# EasyEDA Pro project 主动响应重力卸载系统电控原理图（单车_无步进电机）.eprj

# Schematic 主动响应重力卸载系统

## Sheets
1 综控柜回路: Create Date: 2024-10-10; Page Name: 综控柜回路; Project Name: 507升级改造; Schematic Name: 主动响应重力卸载系统; Update Date: 2024-10-11; Company: 哈尔滨工业大学; Drawed: 徐化睿; Page Size: A4; Reviewed: 王旭、陈海鹏; Version: V1.0
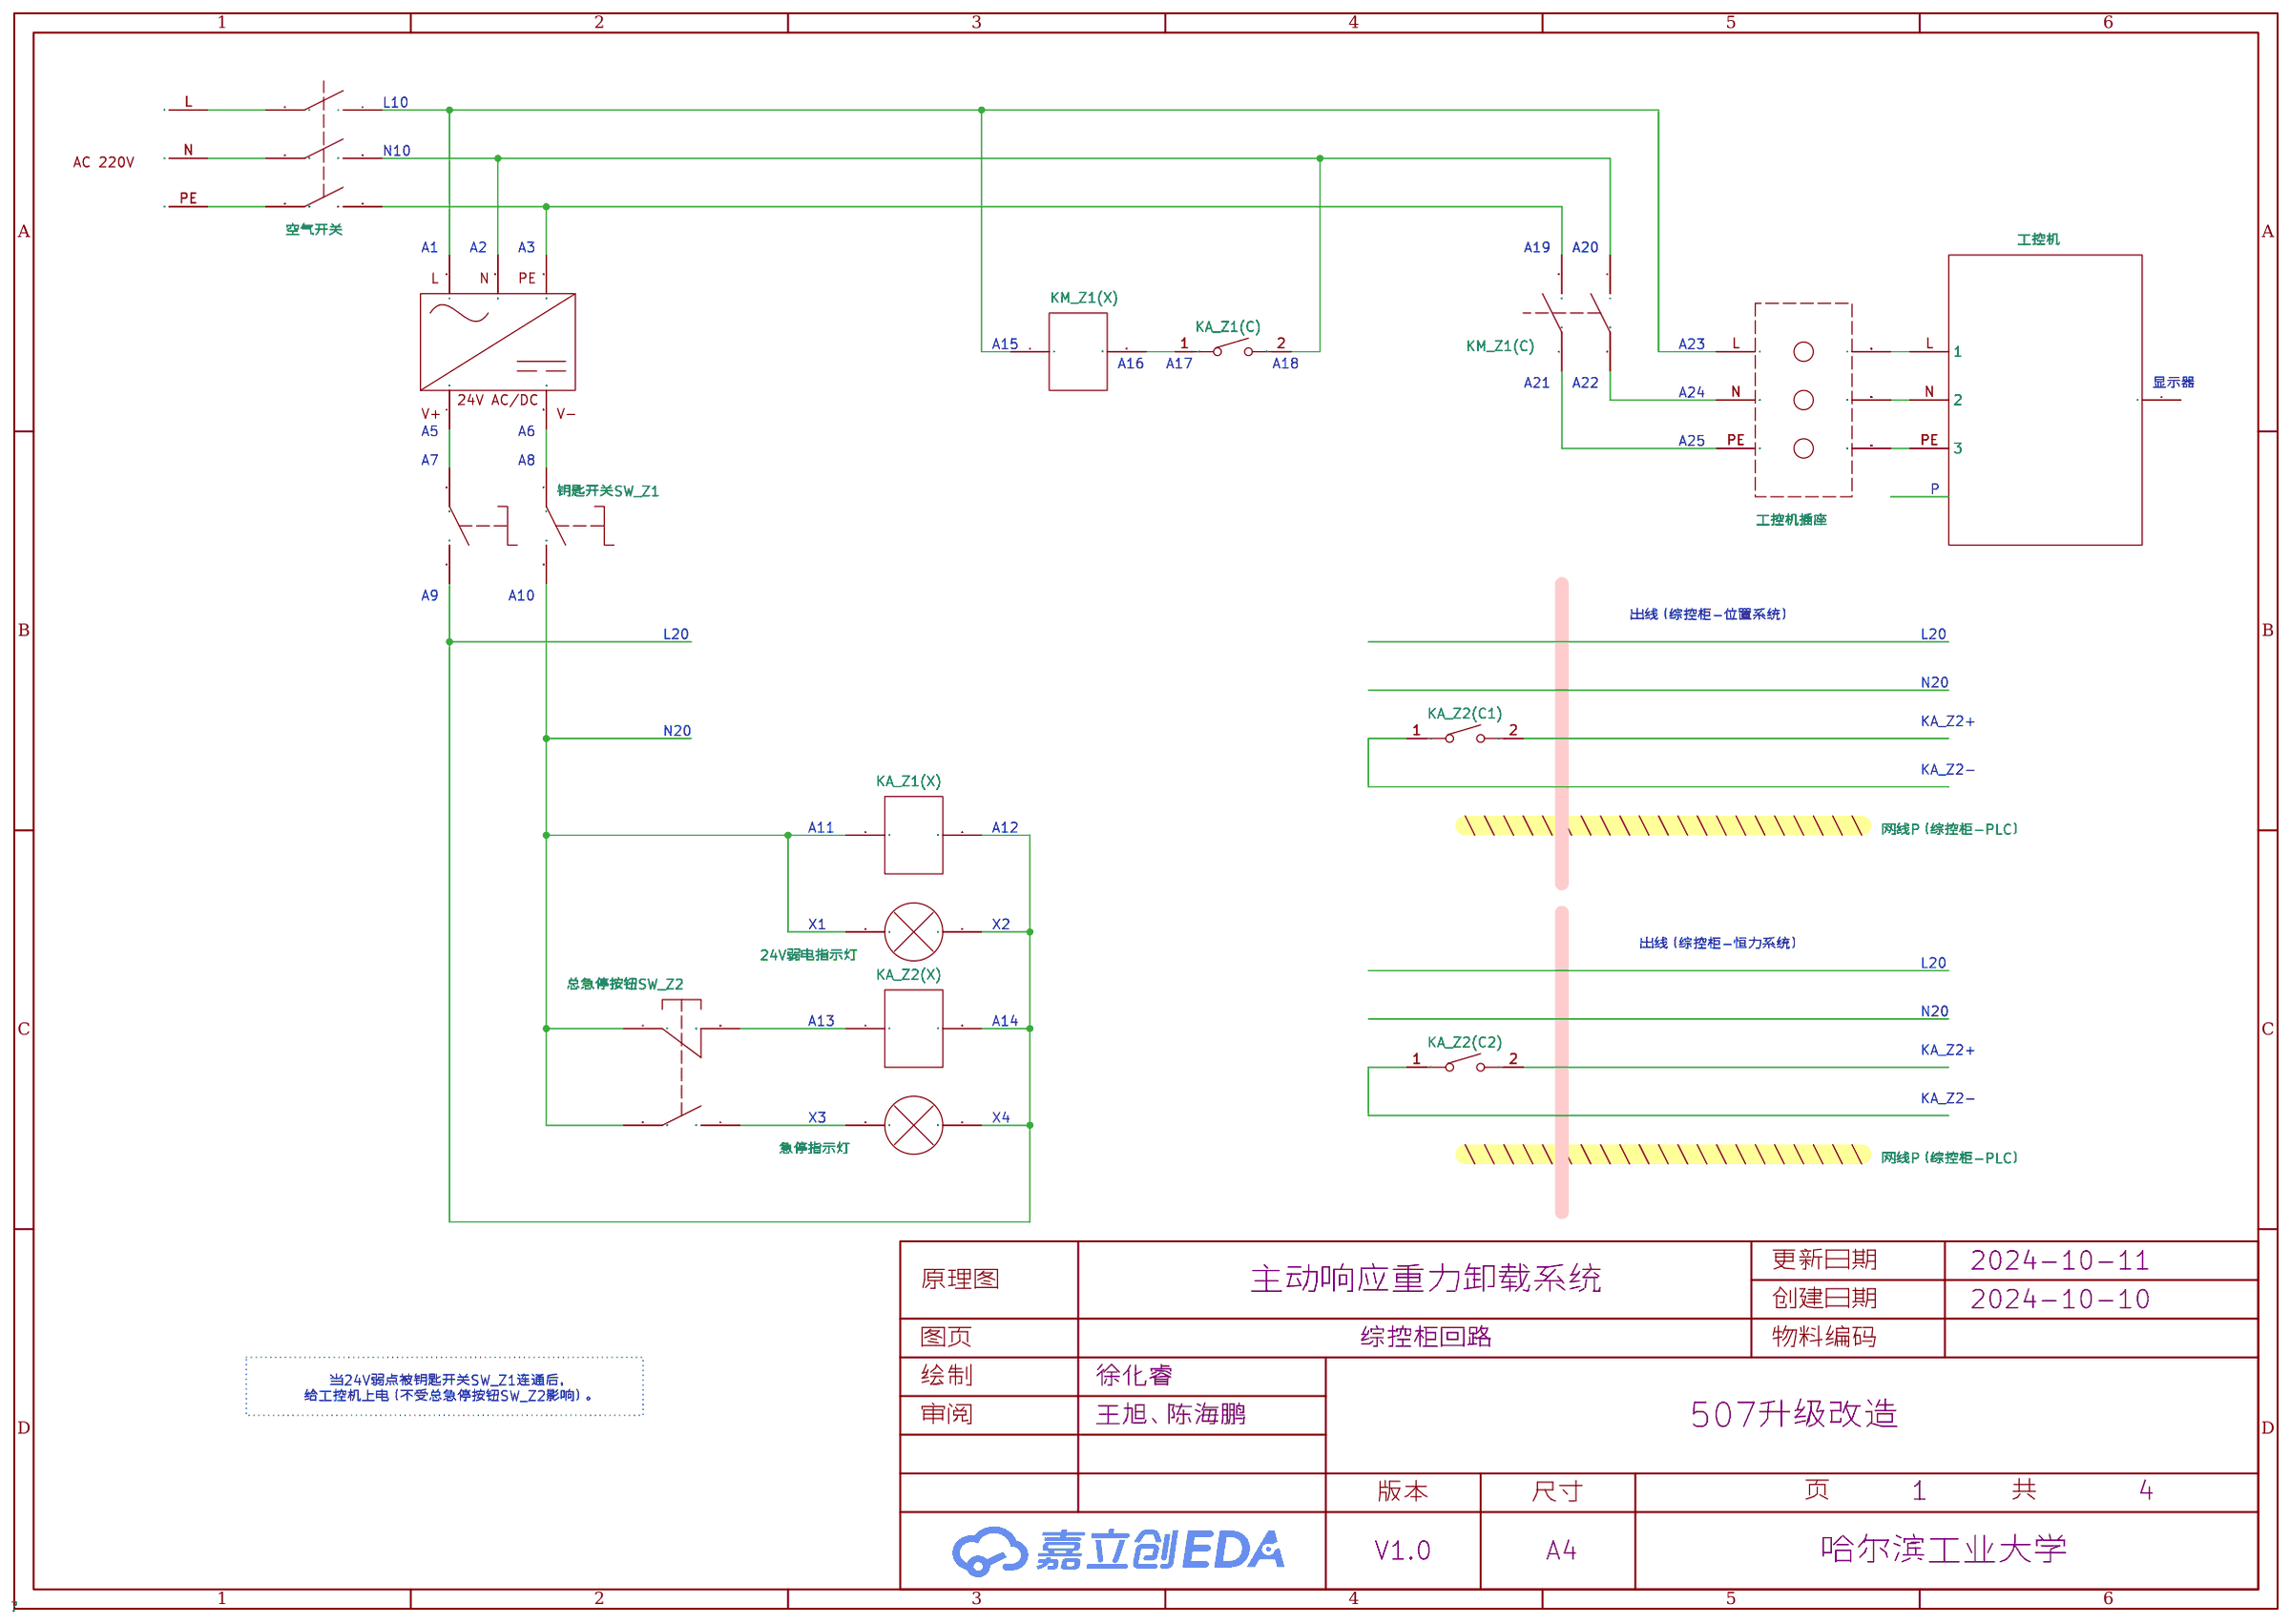
[diagram p0: 综控柜回路]
2 位置系统主回路: Page Name: 位置系统主回路
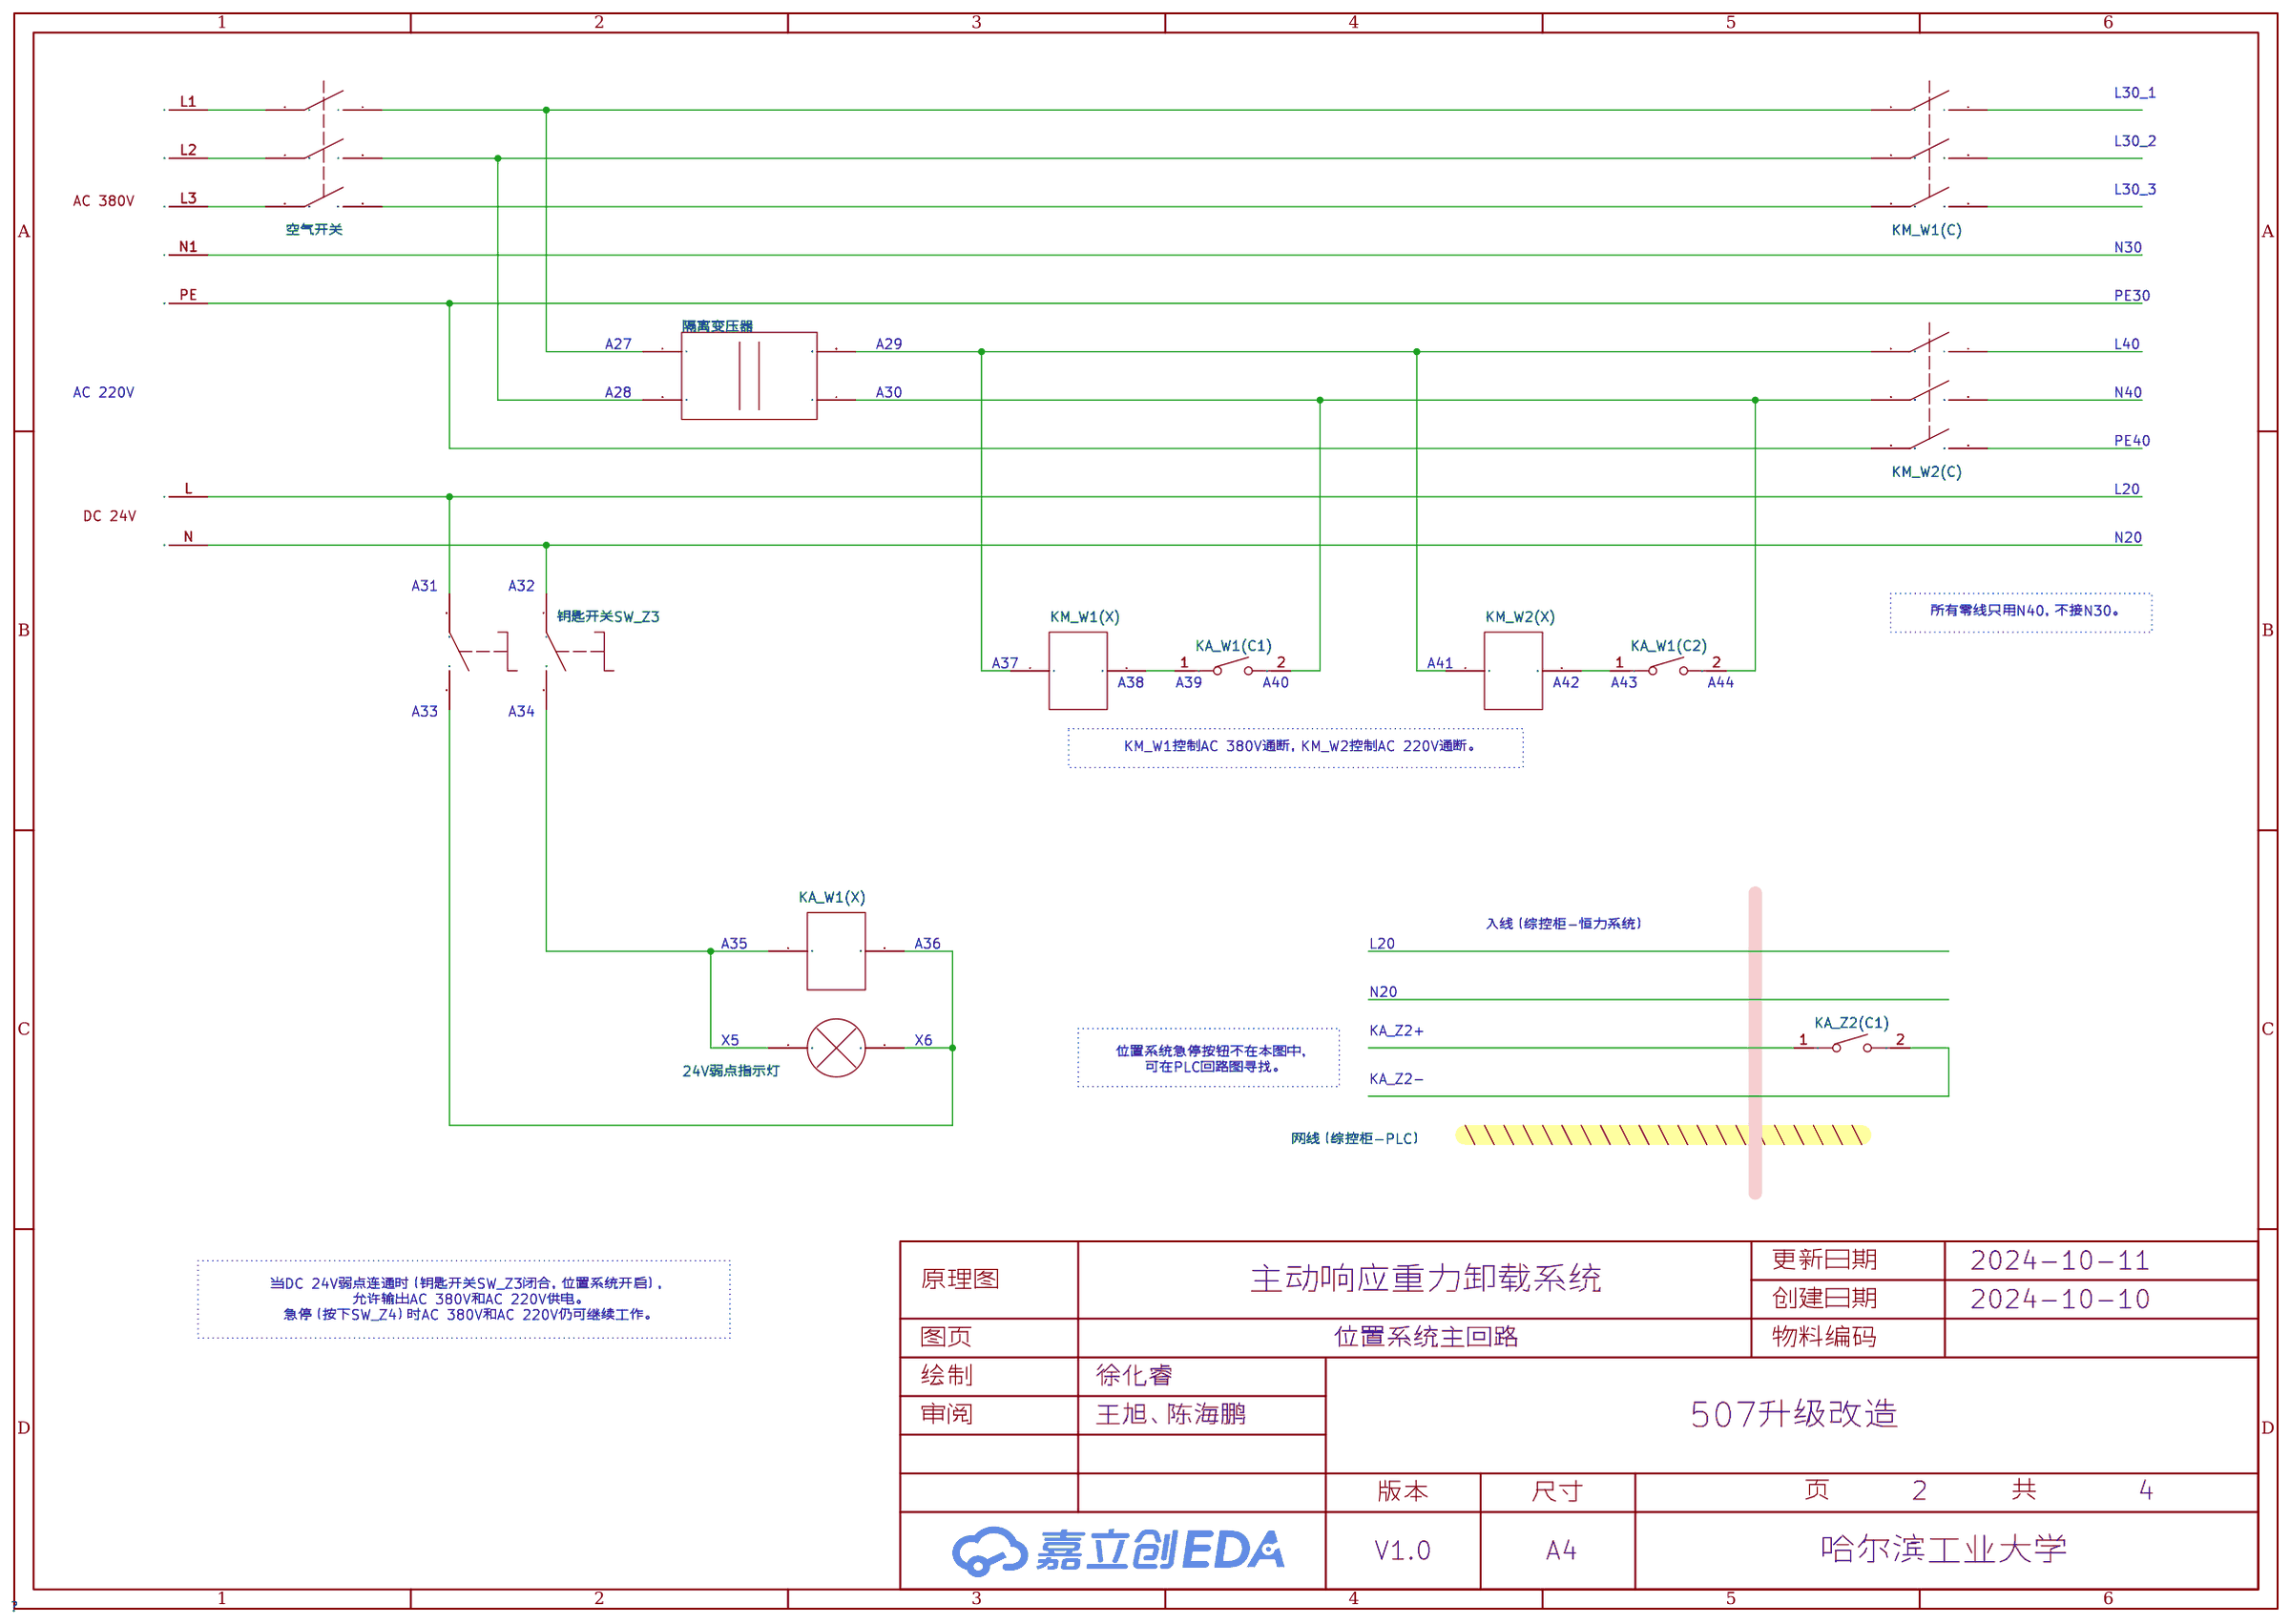
[diagram p1: 位置系统主回路]
3 PLC回路: Create Date: 2024-10-12; Page Name: PLC回路; Project Name: 主动响应重力卸载系统电控原理图（单车_无步进电机）; Update Date: 2024-10-12; Page Size: A3
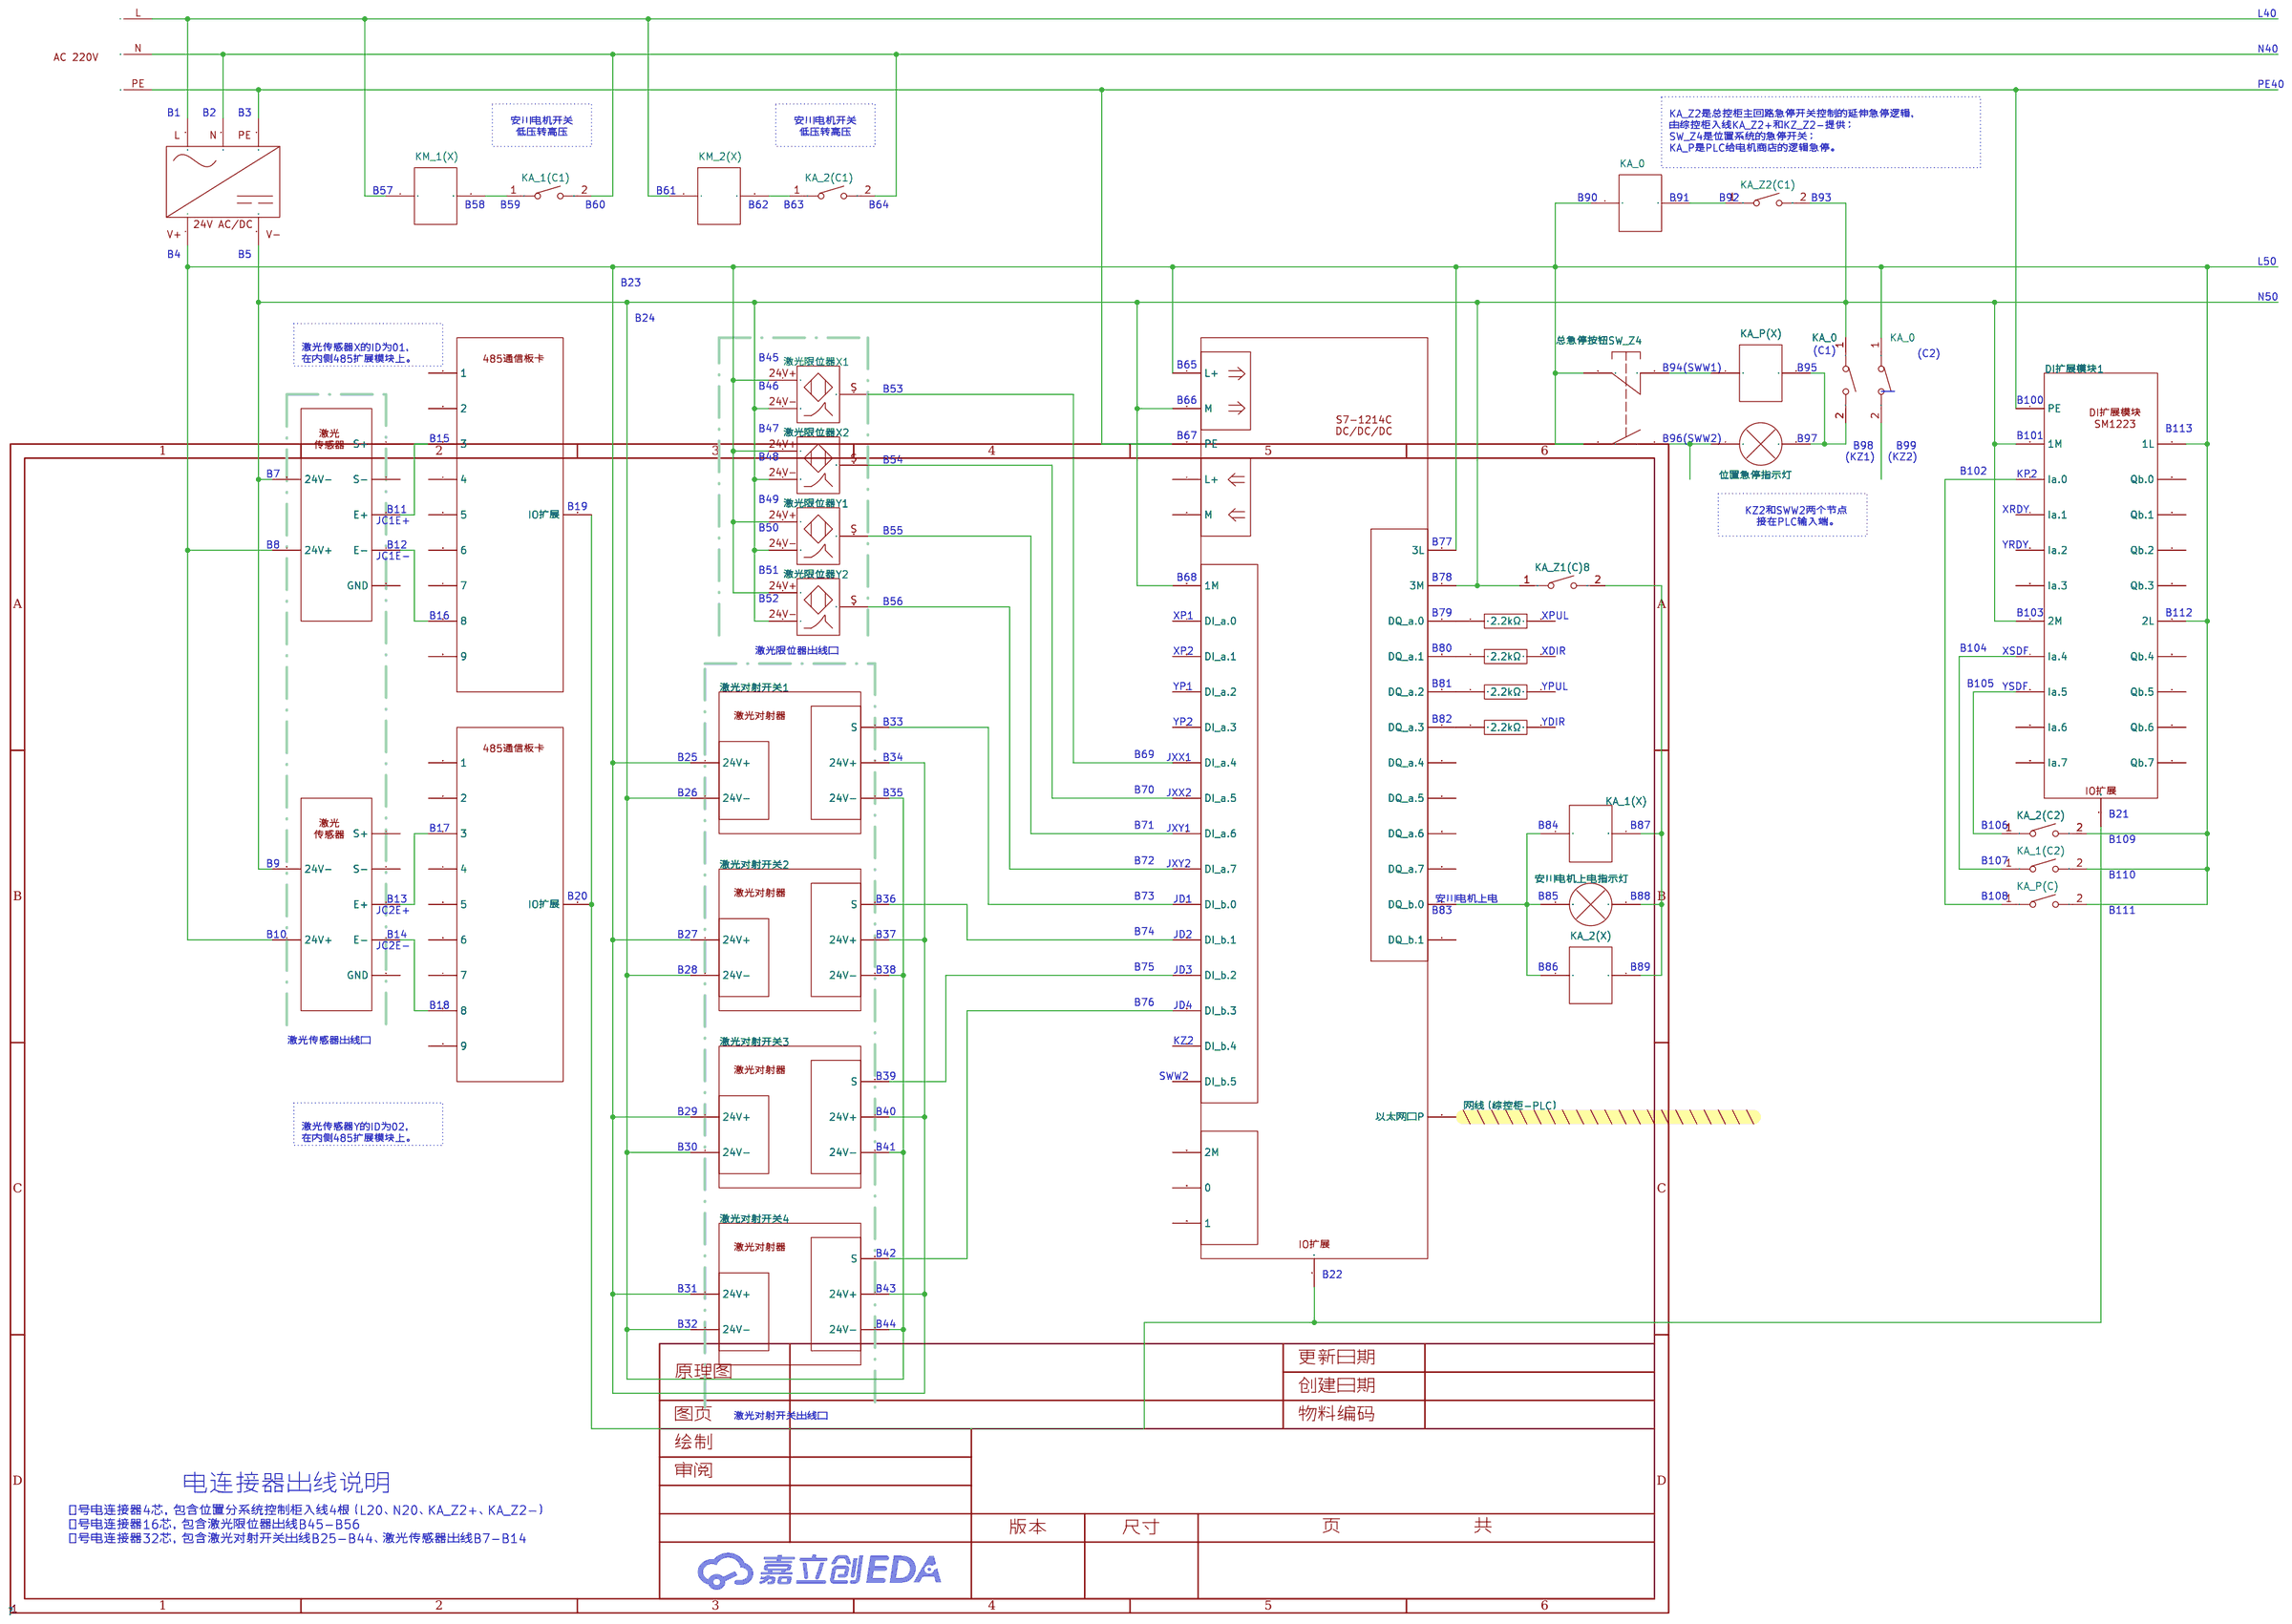
[diagram p2: PLC回路]
4 安川电机驱动器回路: Create Date: 2024-10-11; Page Name: 安川电机驱动器回路
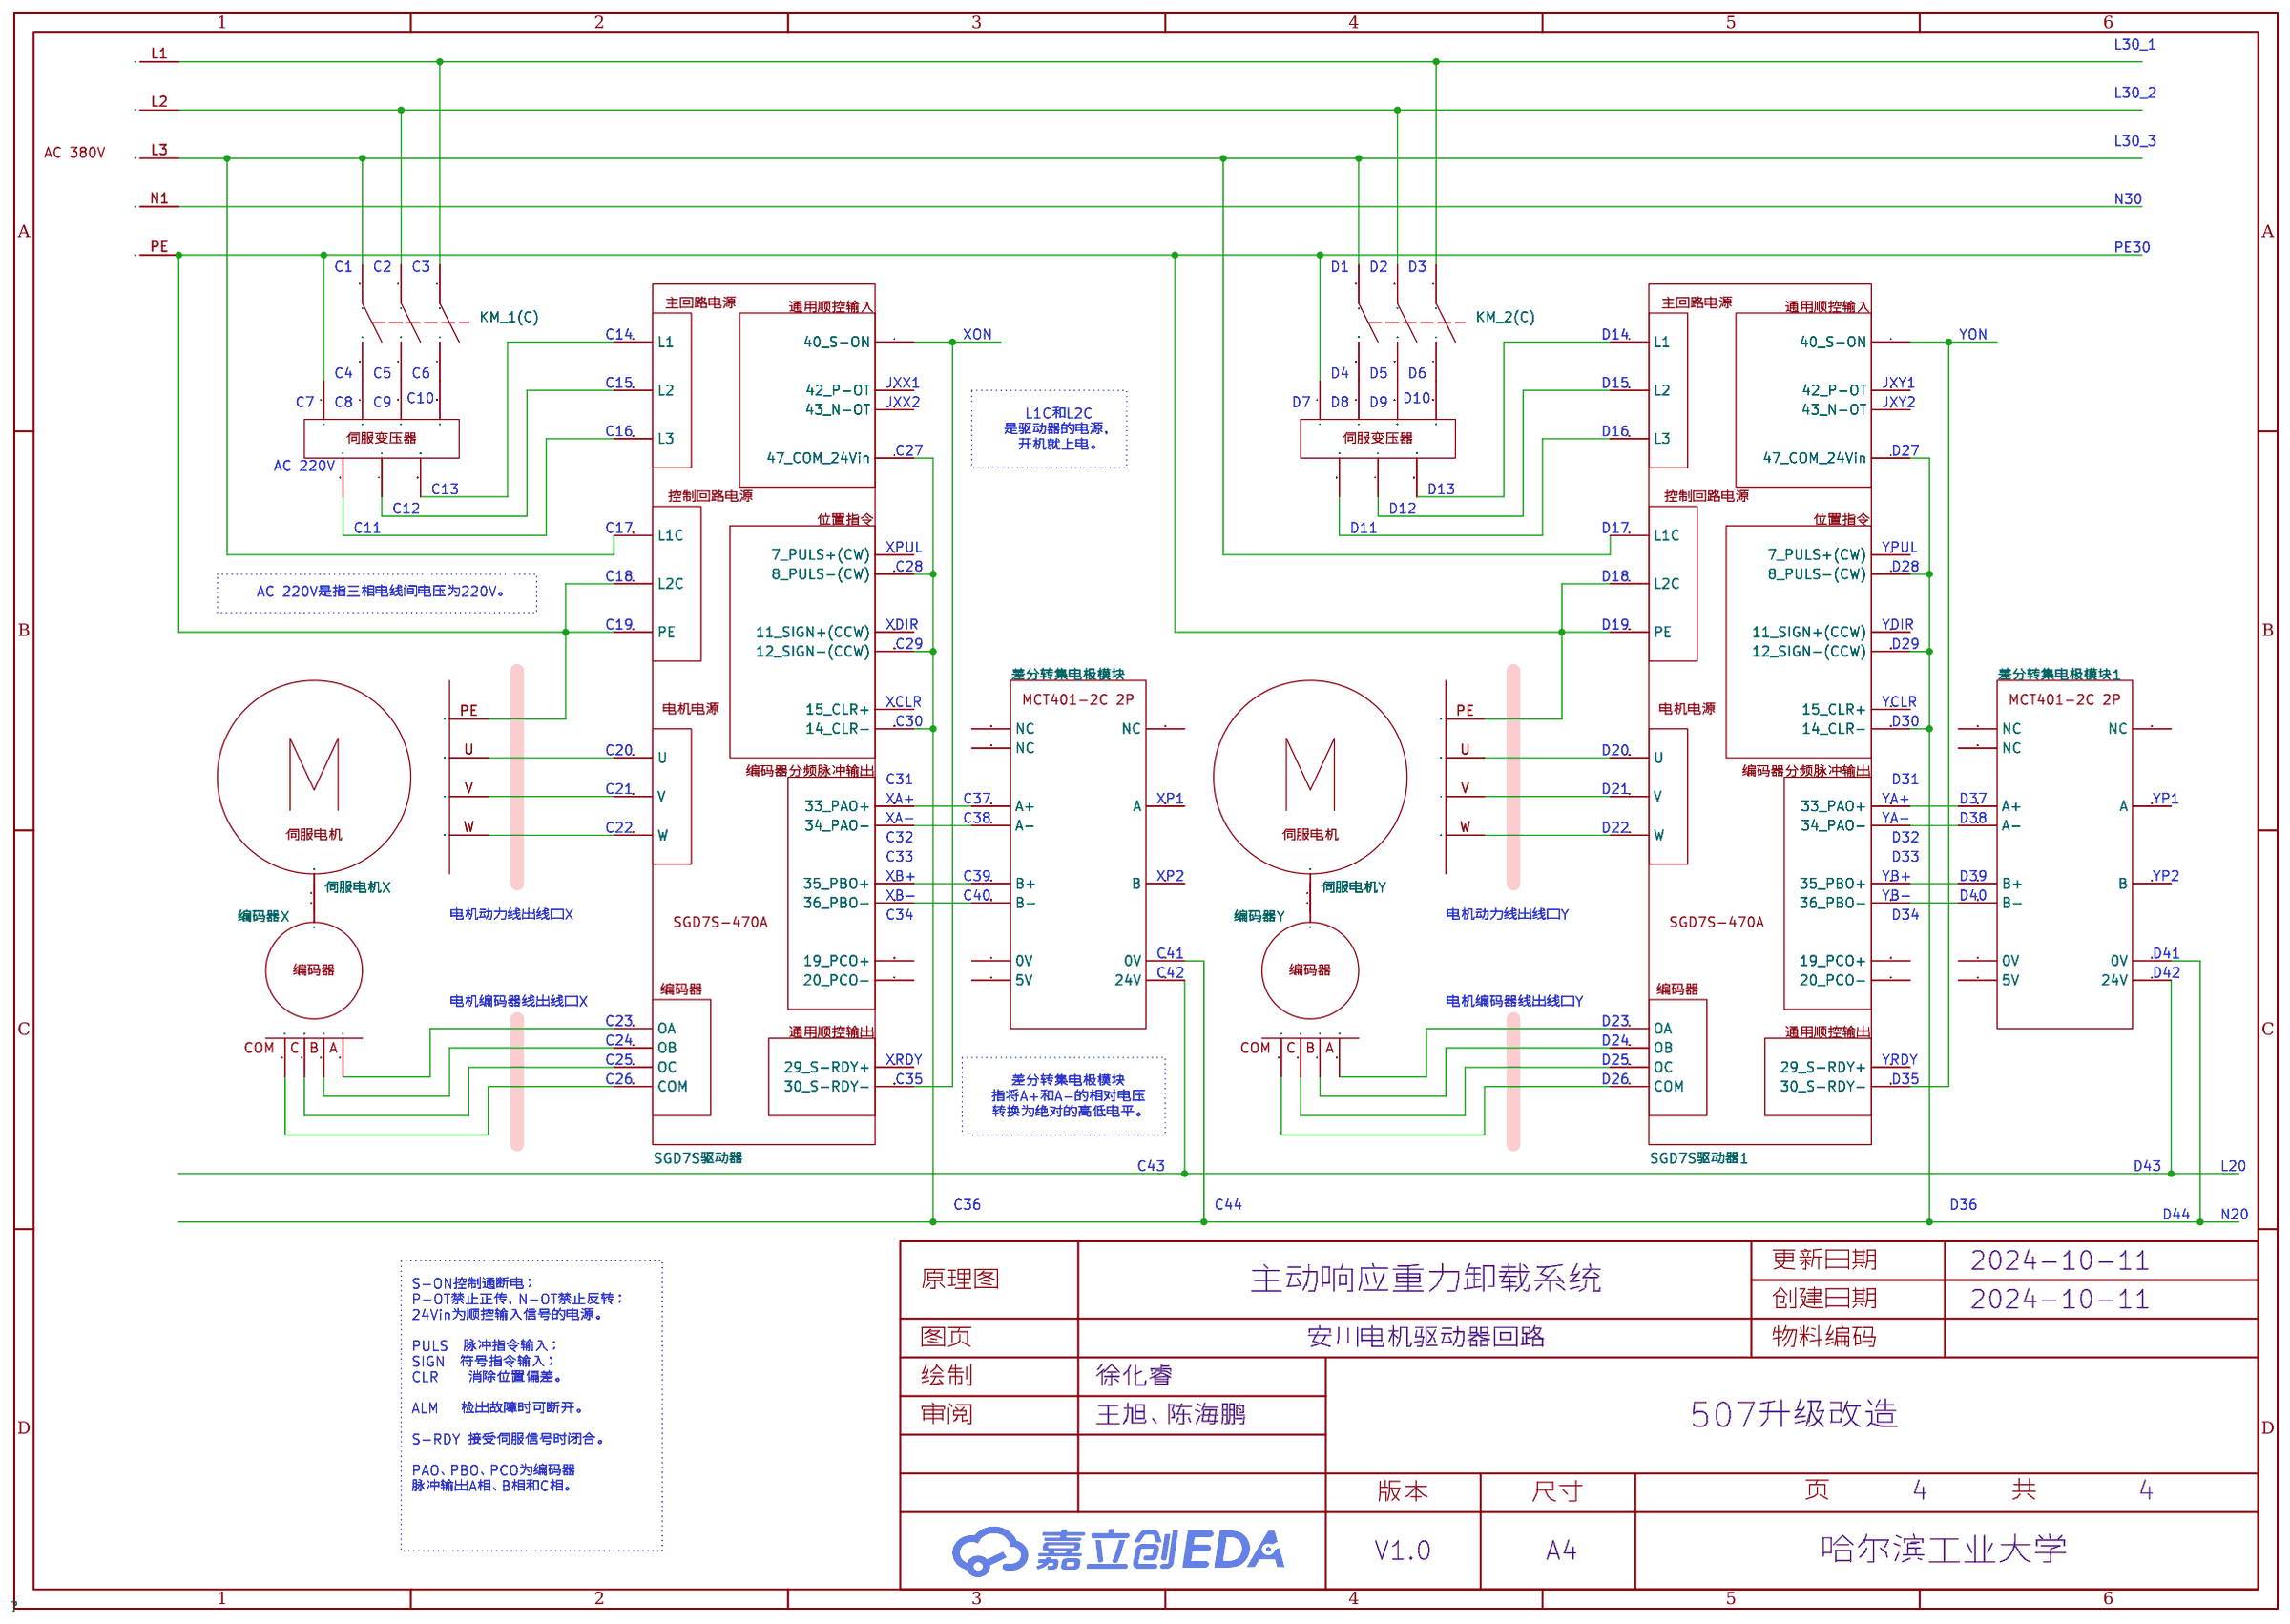
[diagram p3: 安川电机驱动器回路]

## Parts
sheet PLC回路
2.2kΩ  -
2.2kΩ#2  -
2.2kΩ#3  -
2.2kΩ#4  -
DI扩展模块1  -
KA_0  -
KA_0#2  TS-1088-AR02016  [SW-SMD_L3.9-W3.0-P4.45]
KA_0#3  TS-1088-AR02016  [SW-SMD_L3.9-W3.0-P4.45]
KA_1(C1)  TS-1088-AR02016  [SW-SMD_L3.9-W3.0-P4.45]
KA_1(C2)  TS-1088-AR02016  [SW-SMD_L3.9-W3.0-P4.45]
KA_1(X)  -
KA_2(C1)  TS-1088-AR02016  [SW-SMD_L3.9-W3.0-P4.45]
KA_2(C2)  TS-1088-AR02016  [SW-SMD_L3.9-W3.0-P4.45]
KA_2(X)  -
KA_P(C)  TS-1088-AR02016  [SW-SMD_L3.9-W3.0-P4.45]
KA_P(X)  -
KA_Z1(C)8  TS-1088-AR02016  [SW-SMD_L3.9-W3.0-P4.45]
KA_Z2(C1)#3  TS-1088-AR02016  [SW-SMD_L3.9-W3.0-P4.45]
KM_1(X)  -
KM_2(X)  -
U8  -
U9  -
U10  -
U11  -
U12  -
U13  -
U14  -
位置急停指示灯  -
安川电机上电指示灯  -
总急停按钮SW_Z4  -
激光对射开关1  -
激光对射开关2  -
激光对射开关3  -
激光对射开关4  -
激光限位器X1  -
激光限位器X2  -
激光限位器Y1  -
激光限位器Y2  -
sheet 位置系统主回路
24V弱点指示灯  -
KA_W1(C1)  TS-1088-AR02016  [SW-SMD_L3.9-W3.0-P4.45]
KA_W1(C2)  TS-1088-AR02016  [SW-SMD_L3.9-W3.0-P4.45]
KA_W1(X)  -
KA_Z2(C1)#2  TS-1088-AR02016  [SW-SMD_L3.9-W3.0-P4.45]
KM_W1(C)  -
KM_W1(X)  -
KM_W2(C)  -
KM_W2(X)  -
U6  -
U7  -
空气开关#2  -
网线（综控柜-PLC）  -
钥匙开关SW_Z3  -
隔离变压器  -
sheet 安川电机驱动器回路
KM_1(C)  -
KM_2(C)  -
SGD7S驱动器  -
SGD7S驱动器1  -
U17  -
U18  -
U19  -
伺服电机X  -
伺服电机Y  -
差分转集电极模块  -
差分转集电极模块1  -
编码器X  -
编码器Y  -
sheet 综控柜回路
24V弱电指示灯  -
KA_Z1(C)  TS-1088-AR02016  [SW-SMD_L3.9-W3.0-P4.45]
KA_Z1(X)  -
KA_Z2(C1)  TS-1088-AR02016  [SW-SMD_L3.9-W3.0-P4.45]
KA_Z2(C2)  TS-1088-AR02016  [SW-SMD_L3.9-W3.0-P4.45]
KA_Z2(X)  -
KM_Z1(C)  -
KM_Z1(X)  -
U4  -
U5  -
工控机  -
工控机插座  -
急停指示灯  -
总急停按钮SW_Z2  -
空气开关  -
网线P（综控柜-PLC）  -
钥匙开关SW_Z1  -

## Library data of the parts
2.2kΩ 2.2kΩ#2-2.2kΩ#4 = 电阻
DI扩展模块1 = DI扩展模块 SM1223
KA_0 KA_1(X) KA_2(X) KA_P(X) KA_W1(X) KA_Z1(X) KA_Z2(X) KM_1(X) KM_2(X) KM_W1(X) KM_W2(X) KM_Z1(X) = 线圈
KA_0#2 KA_0#3 KA_1(C1) KA_1(C2) KA_2(C1) KA_2(C2) KA_P(C) KA_W1(C1) KA_W1(C2) KA_Z1(C) KA_Z1(C)8 KA_Z2(C1) KA_Z2(C1)#2 KA_Z2(C1)#3 KA_Z2(C2) = TS-1088-AR02016: 电路结构:单刀单掷;按钮形状:圆形按钮;作用力:160gf;安装方式:立贴;开关长度:4mm;开关宽度:3mm;开关高度:2mm;带支架:不带;触点电流:50mA;额定电压(DC):12V;绝缘电阻:100MΩ;机械寿命:10万次;; LCSC Part Name: 4*3*2mm 立贴 轻触开关; Supplier Part: C720477; Manufacturer: XUNPU(讯普); Supplier Footprint: SMD; JLCPCB Part Class: 扩展库; Datasheet: https://atta.szlcsc.com/upload/public/pdf/source/20200810/C720475_60D09DD6C54279ADDB2DC25100F1CC11.pdf; Supplier: LCSC; Circuit: 单刀单掷; Actuator Style: 圆形按钮; Operating Force: 160gf; Mounting Style: 立贴; Switch Length: 4mm; Switch Width: 3mm; Switch Height: 2mm; Strike Gundam: 不带; Contact Current: 50mA; Voltage Rating (DC): 12V; Insulation Resistance: 100MΩ; Actuator/Cap Color: 黑色; Pin Style: SMD接片; Mechanical Life: 10万次; Operating Temperature: -30℃~+80℃
U4 U8 = 220V
U9 = S7-1214C DC/DC/DC
U5 U10 = 24V AC/DC
U11 U12 = 485通信板卡
U13 U14 = 激光传感器
24V弱点指示灯 24V弱电指示灯 位置急停指示灯 安川电机上电指示灯 急停指示灯 = 指示灯
总急停按钮SW_Z2 总急停按钮SW_Z4 = 急停按钮
激光对射开关1-激光对射开关4 = 激光对射开关
激光限位器X1 激光限位器X2 激光限位器Y1 激光限位器Y2 = 激光限位器
KM_W1(C) KM_W2(C) 空气开关 空气开关#2 = 空气开关（三头）
U6 U17 = 380V
U7 = 24V
网线P（综控柜-PLC） 网线（综控柜-PLC） = 网线
钥匙开关SW_Z1 钥匙开关SW_Z3 = 钥匙开关（两头）
隔离变压器 = 隔离变压器
KM_1(C) KM_2(C) = 开关（三头4格）
SGD7S驱动器 SGD7S驱动器1 = SGD7S-470A
U18 U19 = 伺服变压器
伺服电机X 伺服电机Y = 伺服电机
差分转集电极模块 差分转集电极模块1 = MCT401-2C 2P
编码器X 编码器Y = 编码器
KM_Z1(C) = 开关（两头）
工控机 = 工控机
工控机插座 = 工控机插排

## Nets
Net-(2.2kΩ#2-1): 2.2kΩ#2.1 U9.26(DQ a.1)
Net-(2.2kΩ#3-1): 2.2kΩ#3.1 U9.27(DQ a.2)
Net-(2.2kΩ#4-1): 2.2kΩ#4.1 U9.28(DQ a.3)
Net-(2.2kΩ-1): 2.2kΩ.1 U9.25(DQ a.0)
Net-(24V弱点指示灯-1): 24V弱点指示灯.1 KA_W1(X).1 钥匙开关SW_Z3.3
Net-(24V弱点指示灯-2): 24V弱点指示灯.2 KA_W1(X).2 钥匙开关SW_Z3.4
Net-(24V弱电指示灯-1): 24V弱电指示灯.1 KA_Z1(X).1 总急停按钮SW_Z2.1 总急停按钮SW_Z2.2 钥匙开关SW_Z1.3
Net-(24V弱电指示灯-2): 24V弱电指示灯.2 KA_Z1(X).2 KA_Z2(X).2 急停指示灯.2 钥匙开关SW_Z1.4
Net-(DI扩展模块1-1): DI扩展模块1.1(PE) U8.PE(3) U9.3(PE) U10.3
Net-(DI扩展模块1-2): DI扩展模块1.2(1M) DI扩展模块1.21(2M) KA_0#2.1 KA_Z1(C)8.1 KA_Z2(C1)#3.2 U9.2(M) U9.6(1M) U9.24(3M) U10.5 U13.6(24V-) U14.6(24V-) 激光对射开关1.2(24V-) 激光对射开关1.3(24V-) 激光对射开关2.2(24V-) 激光对射开关2.3(24V-) 激光对射开关3.2(24V-) 激光对射开关3.3(24V-) 激光对射开关4.2(24V-) 激光对射开关4.3(24V-) 激光限位器X1.2 激光限位器X2.2 激光限位器Y1.2 激光限位器Y2.2
Net-(DI扩展模块1-3): DI扩展模块1.3(Ia.0) KA_P(C).1
Net-(DI扩展模块1-7): DI扩展模块1.7(Ia.4) KA_1(C2).1
Net-(DI扩展模块1-8): DI扩展模块1.8(Ia.5) KA_2(C2).1
Net-(DI扩展模块1-11): DI扩展模块1.11(1L) DI扩展模块1.20(2L) KA_0.1 KA_0#3.1 KA_1(C2).2 KA_2(C2).2 KA_P(C).2 U9.1(L+) U9.35(3L) U10.4 U13.7(24V+) U14.7(24V+) 总急停按钮SW_Z4.1 总急停按钮SW_Z4.2 激光对射开关1.1(24V+) 激光对射开关1.4(24V+) 激光对射开关2.1(24V+) 激光对射开关2.4(24V+) 激光对射开关3.1(24V+) 激光对射开关3.4(24V+) 激光对射开关4.1(24V+) 激光对射开关4.4(24V+) 激光限位器X1.1 激光限位器X2.1 激光限位器Y1.1 激光限位器Y2.1
Net-(DI扩展模块1-22): DI扩展模块1.22(2M1) U9.37(M1) U11.10(IO扩展) U12.10(IO扩展)
Net-(KA_0#2-2): KA_0#2.2 KA_P(X).2 位置急停指示灯.2
Net-(KA_0-2): KA_0.2 KA_Z2(C1)#3.1
Net-(KA_1(C1)-1): KA_1(C1).1 KM_1(X).2
Net-(KA_1(C1)-2): KA_1(C1).2 KA_2(C1).2 U8.N(2) U10.2
Net-(KA_1(X)-1): KA_1(X).1 KA_2(X).1 U9.33(DQ b.0) 安川电机上电指示灯.1
Net-(KA_1(X)-2): KA_1(X).2 KA_2(X).2 KA_Z1(C)8.2 安川电机上电指示灯.2
Net-(KA_2(C1)-1): KA_2(C1).1 KM_2(X).2
Net-(KA_P(X)-1): KA_P(X).1 总急停按钮SW_Z4.3
Net-(KA_W1(C1)-1): KA_W1(C1).1 KM_W1(X).2
Net-(KA_W1(C1)-2): KA_W1(C1).2 KA_W1(C2).2 KM_W2(C).2 隔离变压器.4
Net-(KA_W1(C2)-1): KA_W1(C2).1 KM_W2(X).2
Net-(KA_Z1(C)-1): KA_Z1(C).1 KM_Z1(X).2
Net-(KA_Z1(C)-2): KA_Z1(C).2 KM_Z1(C).4 U5.2 空气开关.5
Net-(KA_Z2(X)-1): KA_Z2(X).1 总急停按钮SW_Z2.3
Net-(KM_1(C)-1): KM_1(C).1 KM_2(C).1 U17.L1(1)
Net-(KM_1(C)-2): KM_1(C).2 KM_2(C).2 U17.L2(2)
Net-(KM_1(C)-3): KM_1(C).3 KM_2(C).3 SGD7S驱动器.8(L1C) SGD7S驱动器1.8(L1C) U17.L3(3)
Net-(KM_1(C)-4): KM_1(C).4 U18.3
Net-(KM_1(C)-5): KM_1(C).5 U18.2
Net-(KM_1(C)-6): KM_1(C).6 U18.1
Net-(KM_1(X)-1): KM_1(X).1 KM_2(X).1 U8.L(1) U10.1
Net-(KM_2(C)-4): KM_2(C).4 U19.3
Net-(KM_2(C)-5): KM_2(C).5 U19.2
Net-(KM_2(C)-6): KM_2(C).6 U19.1
Net-(KM_W1(C)-1): KM_W1(C).1 空气开关#2.4 隔离变压器.1
Net-(KM_W1(C)-2): KM_W1(C).2 空气开关#2.5 隔离变压器.2
Net-(KM_W1(C)-3): KM_W1(C).3 空气开关#2.6
Net-(KM_W1(X)-1): KM_W1(X).1 KM_W2(C).1 KM_W2(X).1 隔离变压器.3
Net-(KM_W2(C)-3): KM_W2(C).3 U6.PE(5)
Net-(KM_Z1(C)-1): KM_Z1(C).1 工控机插座.PE(3)
Net-(KM_Z1(C)-2): KM_Z1(C).2 工控机插座.N(2)
Net-(KM_Z1(C)-3): KM_Z1(C).3 U5.3 空气开关.6
Net-(KM_Z1(X)-1): KM_Z1(X).1 U5.1 工控机插座.L(1) 空气开关.4
Net-(SGD7S驱动器1-1): SGD7S驱动器1.1(L1) U19.6
Net-(SGD7S驱动器1-2): SGD7S驱动器1.2(L2) U19.7
Net-(SGD7S驱动器1-3): SGD7S驱动器1.3(L3) U19.5
Net-(SGD7S驱动器1-4): SGD7S驱动器1.4(40 S-ON) SGD7S驱动器1.23(30 S-RDY-)
Net-(SGD7S驱动器1-13): SGD7S驱动器1.13(U) 伺服电机Y.U(3)
Net-(SGD7S驱动器1-14): SGD7S驱动器1.14(V) 伺服电机Y.V(4)
Net-(SGD7S驱动器1-15): SGD7S驱动器1.15(W) 伺服电机Y.W(5)
Net-(SGD7S驱动器1-16): SGD7S驱动器1.16(33 PAO+) 差分转集电极模块1.21(A+)
Net-(SGD7S驱动器1-17): SGD7S驱动器1.17(34 PAO-) 差分转集电极模块1.20(A-)
Net-(SGD7S驱动器1-18): SGD7S驱动器1.18(35 PBO+) 差分转集电极模块1.19(B+)
Net-(SGD7S驱动器1-19): SGD7S驱动器1.19(36 PBO-) 差分转集电极模块1.18(B-)
Net-(SGD7S驱动器1-24): SGD7S驱动器1.24(OA) 编码器Y.5
Net-(SGD7S驱动器1-25): SGD7S驱动器1.25(OB) 编码器Y.4
Net-(SGD7S驱动器1-26): SGD7S驱动器1.26(OC) 编码器Y.3
Net-(SGD7S驱动器1-27): SGD7S驱动器1.27(COM) 编码器Y.2
Net-(SGD7S驱动器-1): SGD7S驱动器.1(L1) U18.6
Net-(SGD7S驱动器-2): SGD7S驱动器.2(L2) U18.7
Net-(SGD7S驱动器-3): SGD7S驱动器.3(L3) U18.5
Net-(SGD7S驱动器-4): SGD7S驱动器.4(40 S-ON) SGD7S驱动器.23(30 S-RDY-)
Net-(SGD7S驱动器-7): SGD7S驱动器.7(47 COM 24Vin) SGD7S驱动器.11(8 PULS-(CW)) SGD7S驱动器.28(12 SIGN-(CCW)) SGD7S驱动器.30(14 CLR-) SGD7S驱动器1.7(47 COM 24Vin) SGD7S驱动器1.11(8 PULS-(CW)) SGD7S驱动器1.28(12 SIGN-(CCW)) SGD7S驱动器1.30(14 CLR-) 差分转集电极模块.27(0V) 差分转集电极模块1.27(0V)
Net-(SGD7S驱动器-9): SGD7S驱动器.9(L2C) SGD7S驱动器.10(PE) SGD7S驱动器1.9(L2C) SGD7S驱动器1.10(PE) U17.PE(5) U18.4 U19.4 伺服电机X.PE(2) 伺服电机Y.PE(2)
Net-(SGD7S驱动器-13): SGD7S驱动器.13(U) 伺服电机X.U(3)
Net-(SGD7S驱动器-14): SGD7S驱动器.14(V) 伺服电机X.V(4)
Net-(SGD7S驱动器-15): SGD7S驱动器.15(W) 伺服电机X.W(5)
Net-(SGD7S驱动器-16): SGD7S驱动器.16(33 PAO+) 差分转集电极模块.21(A+)
Net-(SGD7S驱动器-17): SGD7S驱动器.17(34 PAO-) 差分转集电极模块.20(A-)
Net-(SGD7S驱动器-18): SGD7S驱动器.18(35 PBO+) 差分转集电极模块.19(B+)
Net-(SGD7S驱动器-19): SGD7S驱动器.19(36 PBO-) 差分转集电极模块.18(B-)
Net-(SGD7S驱动器-24): SGD7S驱动器.24(OA) 编码器X.5
Net-(SGD7S驱动器-25): SGD7S驱动器.25(OB) 编码器X.4
Net-(SGD7S驱动器-26): SGD7S驱动器.26(OC) 编码器X.3
Net-(SGD7S驱动器-27): SGD7S驱动器.27(COM) 编码器X.2
Net-(U4-L): U4.L(1) 空气开关.1
Net-(U4-N): U4.N(2) 空气开关.2
Net-(U4-PE): U4.PE(3) 空气开关.3
Net-(U5-4): U5.4 钥匙开关SW_Z1.2
Net-(U5-5): U5.5 钥匙开关SW_Z1.1
Net-(U6-L1): U6.L1(1) 空气开关#2.1
Net-(U6-L2): U6.L2(2) 空气开关#2.2
Net-(U6-L3): U6.L3(3) 空气开关#2.3
Net-(U7-L): U7.L(1) 钥匙开关SW_Z3.2
Net-(U7-N): U7.N(2) 钥匙开关SW_Z3.1
Net-(U9-11): U9.11(DI a.4) 激光限位器X1.3
Net-(U9-12): U9.12(DI a.5) 激光限位器X2.3
Net-(U9-13): U9.13(DI a.6) 激光限位器Y1.3
Net-(U9-14): U9.14(DI a.7) 激光限位器Y2.3
Net-(U9-15): U9.15(DI b.0) 激光对射开关1.5(S)
Net-(U9-16): U9.16(DI b.1) 激光对射开关2.5(S)
Net-(U9-17): U9.17(DI b.2) 激光对射开关3.5(S)
Net-(U9-18): U9.18(DI b.3) 激光对射开关4.5(S)
Net-(U11-3): U11.3 U13.3(E+)
Net-(U11-8): U11.8 U13.4(E-)
Net-(U12-3): U12.3 U14.3(E+)
Net-(U12-8): U12.8 U14.4(E-)
Net-(伺服电机X-1): 伺服电机X.1 编码器X.1
Net-(伺服电机Y-1): 伺服电机Y.1 编码器Y.1
Net-(位置急停指示灯-1): 位置急停指示灯.1 总急停按钮SW_Z4.4
Net-(工控机-L): 工控机.L(1) 工控机插座.PE1(4)
Net-(工控机-N): 工控机.N(2) 工控机插座.PE2(5)
Net-(工控机-PE): 工控机.PE(3) 工控机插座.PE3(6)
Net-(差分转集电极模块-28): 差分转集电极模块.28(24V) 差分转集电极模块1.28(24V)
Net-(急停指示灯-1): 急停指示灯.1 总急停按钮SW_Z2.4

Not connected (* = marked no-connect by the designer): 2.2kΩ 2; 2.2kΩ#2 2; 2.2kΩ#3 2; 2.2kΩ#4 2; DI扩展模块1 4(Ia.1) 5(Ia.2) 6(Ia.3) 9(Ia.6) 10(Ia.7) 12(Qb.0) 13(Qb.1) 14(Qb.2) 15(Qb.3) 16(Qb.4) 17(Qb.5) 18(Qb.6) 19(Qb.7); KA_0#3 2; KA_Z2(C1) 1 2; KA_Z2(C1)#2 1 2; KA_Z2(C2) 1 2; KM_W1(C) 4 5 6; KM_W2(C) 4 5 6; SGD7S驱动器 5(42 P-OT) 6(43 N-OT) 12(7 PULS+(CW)) 20(19 PCO+) 21(20 PCO-) 22(29 S-RDY+) 29(11 SIGN+(CCW)) 31(15 CLR+); SGD7S驱动器1 5(42 P-OT) 6(43 N-OT) 12(7 PULS+(CW)) 20(19 PCO+) 21(20 PCO-) 22(29 S-RDY+) 29(11 SIGN+(CCW)) 31(15 CLR+); U6 N1(4); U9 4(L+) 5(M) 7(DI a.0) 8(DI a.1) 9(DI a.2) 10(DI a.3) 19(DI b.4) 20(DI b.5) 21(2M) 22(0) 23(1) 29(DQ a.4) 30(DQ a.5) 31(DQ a.6) 32(DQ a.7) 34(DQ b.1) 36(以太网口P); U11 1 2 4 5 6 7 9; U12 1 2 4 5 6 7 9; U13 1(S+) 2(S-) 5(GND); U14 1(S+) 2(S-) 5(GND); U17 N1(4); 工控机 4; 差分转集电极模块 16(5V) 17(0V) 22(NC) 23(NC) 24(NC) 25(A) 26(B); 差分转集电极模块1 16(5V) 17(0V) 22(NC) 23(NC) 24(NC) 25(A) 26(B)

## Notes on the sheets
sheet 1
- L10
- N10
- A1
- A2
- A3
- A19
- A20
- A15
- A23
- A16
- A17
- A18
- A21
- A22
- A24
- 显示器
- A5
- A6
- A25
- A7
- A8
- P
- A9
- A10
- 出线（综控柜-位置系统）
- L20
- L20
- N20
- KA_Z2+
- N20
- KA_Z2-
- A11
- A12
- X1
- X2
- 出线（综控柜-恒力系统）
- L20
- A13
- A14
- N20
- KA_Z2+
- KA_Z2-
- X3
- X4
- 当24V弱点被钥匙开关SW_Z1连通后，
  给工控机上电（不受总急停按钮SW_Z2影响）。
sheet 2
- L30_1
- L30_2
- L30_3
- N30
- PE30
- A27
- A29
- L40
- AC 220V
- A28
- A30
- N40
- PE40
- L20
- N20
- A31
- A32
- 所有零线只用N40，不接N30。
- A37
- A41
- A38
- A39
- A40
- A42
- A43
- A44
- A33
- A34
- KM_W1控制AC 380V通断，KM_W2控制AC 220V通断。
- 入线（综控柜-恒力系统）
- A35
- A36
- L20
- N20
- X5
- X6
- 位置系统急停按钮不在本图中，
  可在PLC回路图寻找。
- KA_Z2+
- KA_Z2-
- 当DC 24V弱点连通时（钥匙开关SW_Z3闭合，位置系统开启），
  允许输出AC 380V和AC 220V供电。
  急停（按下SW_Z4）时AC 380V和AC 220V仍可继续工作。
sheet 3
- L40
- N40
- PE40
- B1
- B2
- B3
- 安川电机开关
  低压转高压
- 安川电机开关
  低压转高压
- KA_Z2是总控柜主回路急停开关控制的延伸急停逻辑，
  由综控柜入线KA_Z2+和KZ_Z2-提供；
  SW_Z4是位置系统的急停开关；
  KA_P是PLC给电机商店的逻辑急停。
- B57
- B61
- B90
- B91
- B92
- B93
- B58
- B59
- B60
- B62
- B63
- B64
- B4
- B5
- L50
- B23
- N50
- B24
- 激光传感器X的ID为01，
  在内侧485扩展模块上。
- (C1)
- B45
- B65
- (C2)
- B46
- B94(SWW1)
- B95
- B53
- B66
- B100
- B47
- B67
- B101
- B113
- B15
- B96(SWW2)
- B97
- B98
- B99
- B48
- B54
- (KZ1)
- (KZ2)
- B7
- B102
- KP2
- B49
- B11
- JC1E+
- B19
- KZ2和SWW2两个节点
  接在PLC输入端。
- XRDY
- B50
- B55
- B8
- B12
- B77
- YRDY
- JC1E-
- B51
- B68
- B78
- B52
- B16
- B56
- XP1
- B79
- XPUL
- B103
- B112
- B80
- B104
- 激光限位器出线口
- XP2
- XDIR
- XSDF
- B81
- B105
- YP1
- YPUL
- YSDF
- B82
- B33
- YP2
- YDIR
- B69
- B25
- B34
- JXX1
- B26
- B35
- B70
- JXX2
- B21
- B17
- B71
- JXY1
- B84
- B87
- B106
- B109
- B9
- B72
- JXY2
- B107
- B110
- B13
- B20
- B36
- B73
- JD1
- 安川电机上电
- B85
- B88
- B108
- JC2E+
- B83
- B111
- B10
- B14
- B27
- B37
- B74
- JD2
- JC2E-
- B75
- B86
- B89
- B28
- B38
- JD3
- B76
- B18
- JD4
- 激光传感器出线口
- KZ2
- B39
- SWW2
- 激光传感器Y的ID为02，
  在内侧485扩展模块上。
- B29
- B40
- B30
- B41
- B42
- B22
- B31
- B43
- B32
- B44
- 激光对射开关出线口
- 电连接器出线说明
- Ⅰ号电连接器4芯，包含位置分系统控制柜入线4根（L20、N20、KA_Z2+、KA_Z2-）
  Ⅱ号电连接器16芯，包含激光限位器出线B45-B56
  Ⅲ号电连接器32芯，包含激光对射开关出线B25-B44、激光传感器出线B7-B14
sheet 4
- L30_1
- L30_2
- L30_3
- N30
- C1
- C2
- C3
- D1
- D2
- D3
- PE30
- C14
- XON
- D14
- YON
- C4
- C5
- C6
- D4
- D5
- D6
- C7
- C8
- C9
- C10
- C15
- JXX1
- JXX2
- L1C和L2C
  是驱动器的电源，
  开机就上电。
- D7
- D8
- D9
- D10
- D15
- JXY1
- JXY2
- C16
- C27
- D16
- D27
- AC 220V
- C13
- D13
- C12
- D12
- C11
- C17
- D11
- D17
- XPUL
- YPUL
- AC 220V是指三相电线间电压为220V。
- C18
- C28
- D18
- D28
- C19
- XDIR
- D19
- YDIR
- C29
- D29
- XCLR
- YCLR
- C30
- D30
- C20
- D20
- C21
- C31
- D21
- D31
- XA+
- C37
- XP1
- YA+
- D37
- YP1
- C22
- C32
- XA-
- C38
- D22
- YA-
- D32
- D38
- C33
- D33
- XB+
- C39
- XP2
- YB+
- D39
- YP2
- XB-
- C40
- YB-
- D40
- 电机动力线出线口X
- C34
- 电机动力线出线口Y
- D34
- C41
- D41
- C42
- D42
- 电机编码器线出线口X
- C23
- 电机编码器线出线口Y
- D23
- C24
- D24
- C25
- XRDY
- D25
- YRDY
- C26
- C35
- 差分转集电极模块
  指将A+和A-的相对电压
  转换为绝对的高低电平。
- D26
- D35
- C43
- D43
- L20
- C36
- C44
- D36
- D44
- N20
- S-ON控制通断电；
  P-OT禁止正传，N-OT禁止反转；
  24Vin为顺控输入信号的电源。
  PULS  脉冲指令输入；
  SIGN  符号指令输入；
  CLR    消除位置偏差。
  ALM   检出故障时可断开。
  S-RDY 接受伺服信号时闭合。
  PAO、PBO、PCO为编码器
  脉冲输出A相、B相和C相。
